# EAGLE design LB_BIT_1IN_1OUT-XXLWIDE-v03(1_1x) (EAGLE 6.5.0)
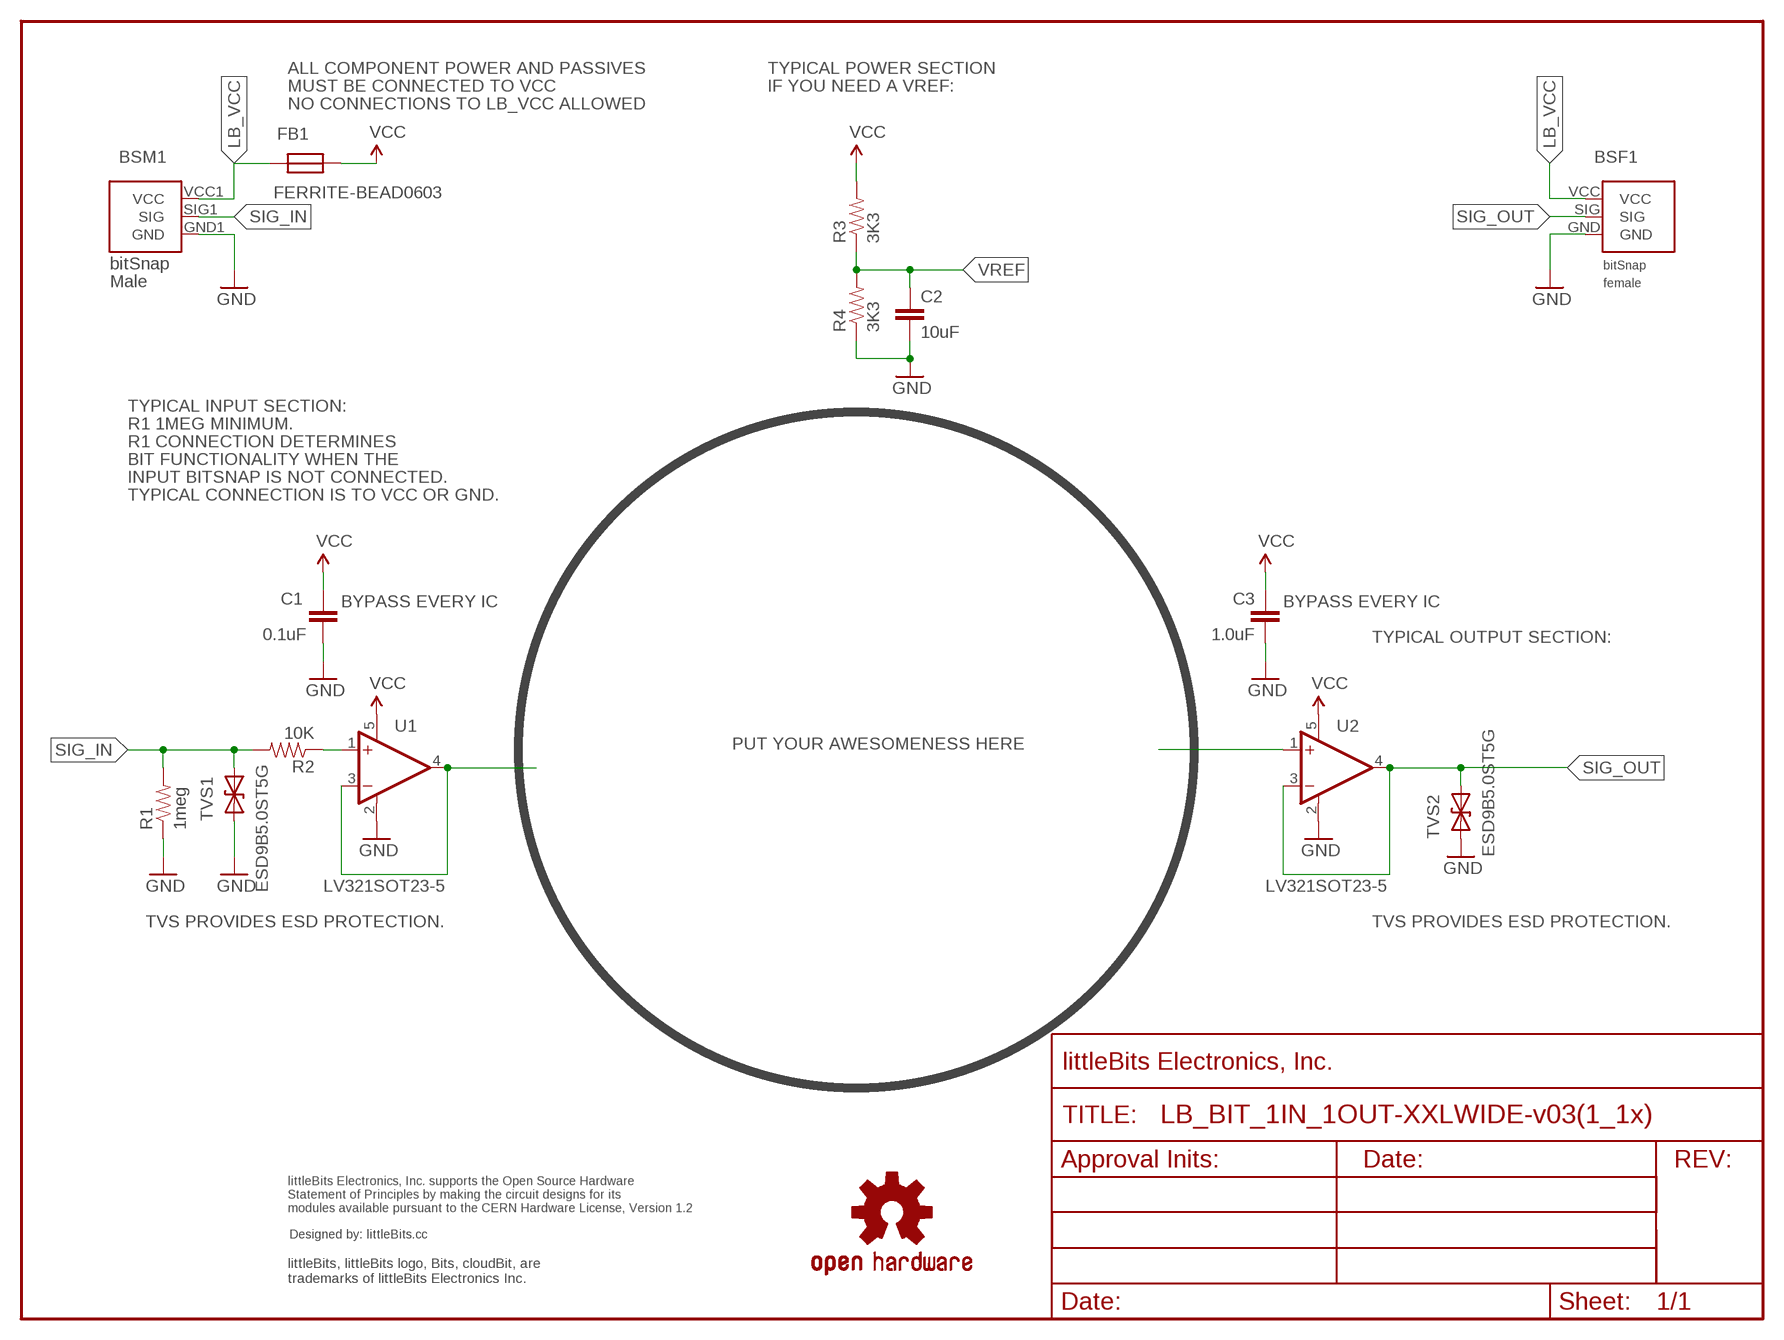
[diagram p0: schematic, sheet 1]

## Parts
BSF1  BITSNAP_V03_FEMALE  [BITSNAP_V03_FEMALE]
BSM1  BITSNAP_V03_MALE  [BITSNAP_V03_MALE]
C1  0.1uF  CAPCAP-0603  [CAP-0603]
C2  10uF  CAPCAP-0603  [CAP-0603]
C3  1.0uF  CAPCAP-0603  [CAP-0603]
FB1  FERRITE-BEAD0603  [R0603]
R1  1meg  RESISTOR0603  [RES-0603]
R2  10K  RESISTOR0603  [RES-0603]
R3  3K3  RESISTOR0603  [RES-0603]
R4  3K3  RESISTOR0603  [RES-0603]
TVS1  ESD9B5.0ST5G  DIODE-TVSSOD-923  [SOD-923]
TVS2  ESD9B5.0ST5G  DIODE-TVSSOD-923  [SOD-923]
U1  LV321SOT23-5  [SOT23-5]
U2  LV321SOT23-5  [SOT23-5]
U$1  OSHW-LOGOL  [OSHW-LOGO-L]
U$2  OSHWCREDIT  [OSHWCREDIT]
U$5  FRAME-LETTER-OHWOHW  [FABDWG01-OHW]

## Nets
GND: BSF1.GND BSM1.GND1(GND) C1.2 C2.2 C3.1 R1.1 R4.1 TVS1.1(A) TVS2.1(A) U1.2(V-) U2.2(V-)
LB_VCC: BSF1.VCC BSM1.VCC1(VCC) FB1.2
N$2: U1.3(-IN) U1.4(OUT)
N$3: U2.1(+IN)
N$4: R2.1 U1.1(+IN)
SIG_IN: BSM1.SIG1(SIG) R1.2 R2.2 TVS1.2(C)
SIG_OUT: BSF1.SIG TVS2.2(C) U2.3(-IN) U2.4(OUT)
VCC: C1.1 C3.2 FB1.1 R3.2 U1.5(V+) U2.5(V+)
VREF: C2.1 R3.1 R4.2

## Notes on the sheet
- ALL COMPONENT POWER AND PASSIVES | TYPICAL POWER SECTION
- MUST BE CONNECTED TO VCC | IF YOU NEED A VREF:
- NO CONNECTIONS TO LB_VCC ALLOWED
- TYPICAL INPUT SECTION:
- R1 1MEG MINIMUM.
- R1 CONNECTION DETERMINES
- BIT FUNCTIONALITY WHEN THE
- INPUT BITSNAP IS NOT CONNECTED.
- TYPICAL CONNECTION IS TO VCC OR GND.
- BYPASS EVERY IC | BYPASS EVERY IC
- TYPICAL OUTPUT SECTION:
- PUT YOUR AWESOMENESS HERE
- TVS PROVIDES ESD PROTECTION. | TVS PROVIDES ESD PROTECTION.

## Library data of the parts
BSF1 = bitSnap:BITSNAP_V03_FEMALE
BSM1 = bitSnap:BITSNAP_V03_MALE
C1-C3 = LITTLEBITS:CAP
FB1 = LITTLEBITS:FERRITE-BEAD
R1-R4 = LITTLEBITS:RESISTOR
TVS1 TVS2 = LITTLEBITS:DIODE-TVS: Bidirectional Transient Voltage Suppression Diode: Device conducts in avalanche mode after reaching a part dependent voltage threshold. Used for limiting voltage spikes on ESD sensitive inputs and outputs.; IEC_ESD_PROT0: +/-18kV; LB_PN: ?; MPN: ESD9B5.0ST5G; V_CLAMP: ?; V_OPERATION: 5V
U1 U2 = LITTLEBITS:LV321
U$1 = LITTLEBITS131206:OSHW-LOGO: Open Source Hardware Logo This logo indicates the piece of hardware it is found on incorporates a OSHW license and/or adheres to the definition of open source hardware found here: http://freedomdefined.org/OSHW
U$2 = LITTLEBITS:OSHWCREDIT
U$5 = LITTLEBITS:FRAME-LETTER-OHW

## Board
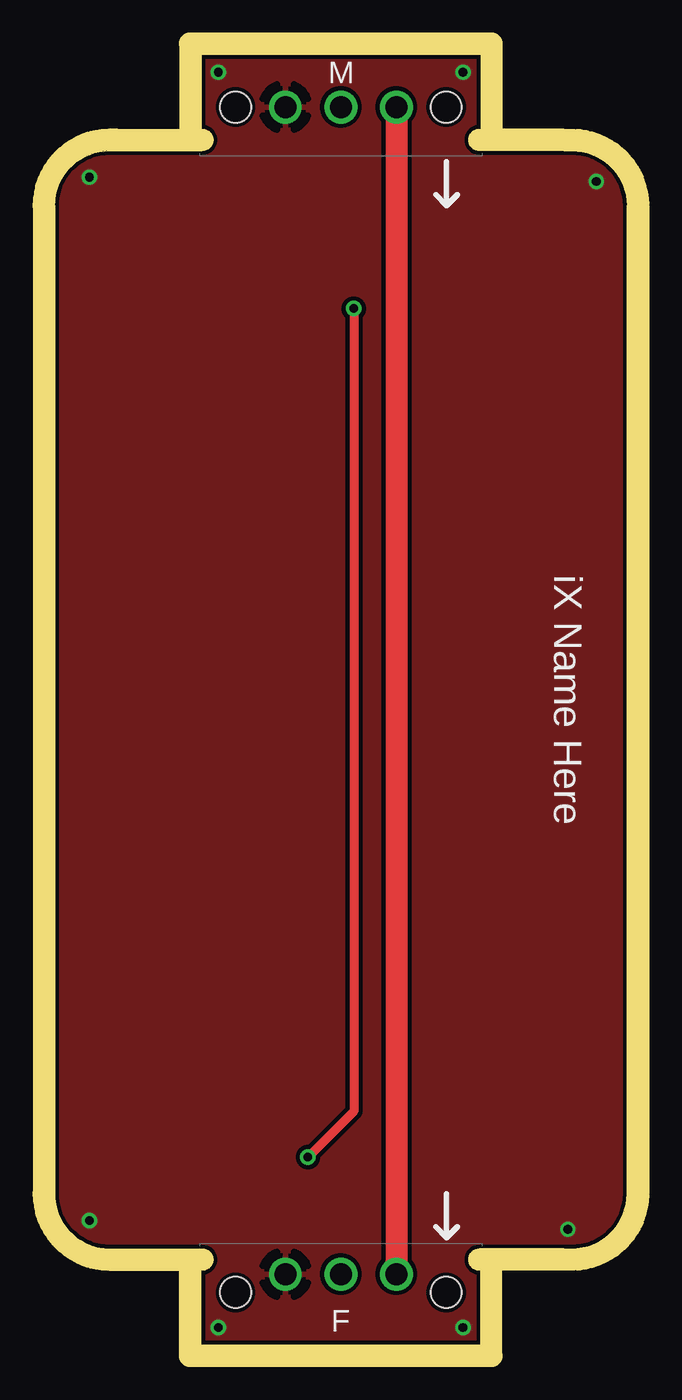
[diagram p1: board, top side]
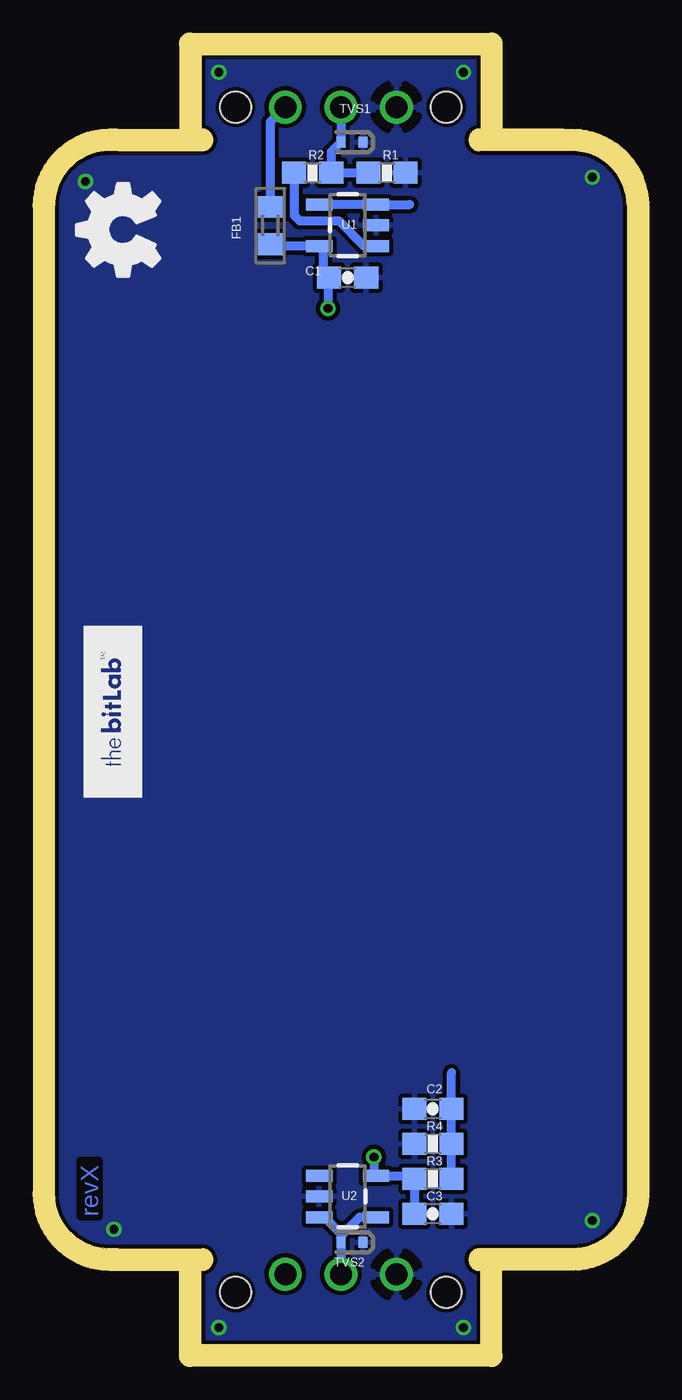
[diagram p2: board, bottom side, seen from below]

Size 26.2 x 59.02 mm. Coordinates in mm from the lower left corner, seen from the top.
Outline: 2.9,4.4 2.5,4.4 arc-90 0,6.9 0,52.12 arc-90 2.5,54.62 2.9,54.62
Outline: 23.3,54.62 23.7,54.62 arc-90 26.2,52.12 26.2,6.9 arc-90 23.7,4.4 23.3,4.4
Copper layers (1*16): Top 0.035mm / dielectric 1.5mm / Bottom 0.035mm
Design rules "default": minimum track width 0.2mm, minimum drill 0.4mm, track to track 0.2mm, track to pad 0.2mm, pad to pad 0.2mm, via to via 0.2mm, smd to smd 0mil, copper to edge 0.2mm, drill to drill 0.2mm, minimum pad ring 0.2mm, minimum via ring 0.15mm, stop-mask expansion 0.1mm, vias tented up to drill 0mil, thermal gap 0.2mm
Milling: 10 lines

### Footprints (pad centres in the part's own frame; a part is rotated, then mirrored left to right if it is on the bottom)
BITSNAP_V03_FEMALE = drill 1: GND 4.065,3.44; SIG 6.605,3.44; VCC 9.145,3.44 | hole 1.4: 1.785,2.61; 11.425,2.61
BITSNAP_V03_MALE = drill 1: GND1 9.145,2.61; SIG1 6.605,2.61; VCC1 4.065,2.61 | hole 1.4: 1.785,2.61; 11.425,2.61
CAP-0603 = smd 1.1 x 1: 1 -0.85,0; 2 0.85,0
R0603 = smd 1 x 1.1: 1 -0.85,0; 2 0.85,0
RES-0603 = smd 1.1 x 1: 1 -0.85,0; 2 0.85,0
SOD-923 = smd 0.4 x 0.5: 1 -0.5,0; 2 0.5,0
SOT23-5 = smd 0.55 x 1.2: 1 -0.95,-1.3; 2 0,-1.3; 3 0.95,-1.3; 4 0.95,1.3; 5 -0.95,1.3

### Placement (x,y rotation side)
BSF1  6.5,-0.21 0 top
BSM1  19.71,59.23 180 top
C1  12.79,48.82 0 bottom
C2  8.89,10.8 180 bottom
C3  8.89,6 180 bottom
FB1  16.33,51.21 90 bottom
R1  10.99,53.62 180 bottom
R2  14.39,53.62 0 bottom
R3  8.89,7.6 180 bottom
R4  8.89,9.2 0 bottom
TVS1  12.59,55.02 180 bottom
TVS2  12.59,4.69 180 bottom
U1  12.79,51.22 90 bottom
U2  12.79,6.79 270 bottom
U$1  -37.62,-68.43 0 top  (outside the outline)
U$2  -92.35,-64.52 0 top  (outside the outline)
U$3  [BITLAB-LOGO]  22.19,32.89 270 top
U$4  [OSHW_FILLX150_NOTEXT]  21.39,48.89 90 bottom
U$5  -0.11,-0.21 0 top

### Tracks (layer width: path | path; a pad name or v marks a point on that pad's centre or on a via)
GND  (via drill 0.4)
  other vias: 7.49,0.79 18.69,0.79 23.49,5.29 24.79,53.22 18.69,58.22 7.49,58.22 1.59,53.42 1.59,5.69
  pour Bottom: -0.39,-0.12 26.62,-0.12 26.62,59.01 -0.39,59.01
  pour Top: -0.39,-0.12 26.62,-0.12 26.62,59.01 -0.39,59.01
LB_VCC
  Top 1: BSM1.VCC1 BSF1.VCC
  Bottom 0.406: BSM1.VCC1 16.33,55.94 FB1.2
N$2
  Bottom 0.406: U1.4 U1.3 9.94,52.17
N$4
  Bottom 0.406: R2.1 15.24,51.67 14.99,51.42 13.19,51.42 12.04,50.27 U1.1
SIG_IN
  Bottom 0.406: R1.2 R2.2 13.54,54.57 TVS1.2 13.09,56.62 BSM1.SIG1
SIG_OUT
  Bottom 0.406: U2.4 12.24,5.84 13.09,4.99 TVS2.2 | U2.3 13.84,5.84 13.09,5.09 TVS2.2 | TVS2.2 BSF1.SIG
VCC  (via drill 0.4)
  Top 0.406: v13.69,47.41 13.69,10.69 v11.59,8.59
  Bottom 0.406: U1.5 16.33,50.27 FB1.1 | R3.2 | U1.5 14.04,50.22 | 9.84,5.8 C3.2 R3.2 | U1.5 13.89,50.27 13.89,48.82 C1.1 13.69,48.82 v13.69,47.41 | R3.2 9.74,7.74 U2.5 11.59,7.84 v11.59,8.59
VREF
  Bottom 0.406: R3.1 R4.2 C2.1 8.04,12.45

### Text on the board
Bottom: revX
tPlace: iX Name Here